# Altium project P22296-2-DES.PrjPcb
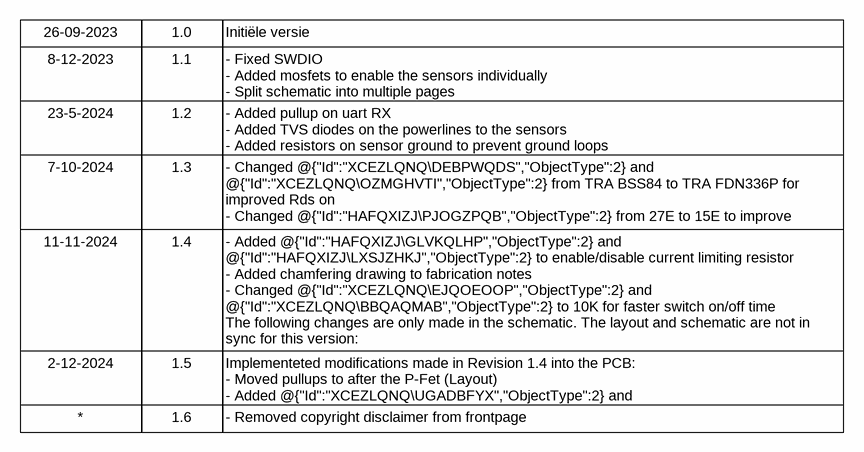
[diagram p0: Frontpage.SchDoc]
VolgNumber: 2; ProjectRev: 1.6; ProjectNumber: P22296; Project: MFM Sensor board; ProductNumber: P4750; PCBRev: 1.4; DrawnBy: KRS; Drawingnumber: P22296-2-DES-1; DCISheetTotal: 4
5 sheets, 95 parts. Net scope: global (net labels, ports and power ports of the same name join across sheets).
Board file: P22296-2-PCB.PcbDoc
Sheets:
  Frontpage.SchDoc
  MCU.SchDoc
  Sensor Interface.SchDoc
  Power.SchDoc
  Mechanical.SchDoc

## Sheet Frontpage.SchDoc: Titel
size A4 portrait; ApprovedBy: name; CompanyName: DCI Electronics bv; DrawnBy: KRS; Address1: Nijverheidsstraat 14; Address2: 4458 AV Eindewege; Address3: Phone: +31 (0)113 344880; DocumentNumber: 0; Revision: 0; SheetNumber: 1; SheetTotal: 5; PageSetup: Record=PageOptions|CenterHorizontal=True|CenterVertical=True|PrintScale=1.00|XCorrection=1.00|YCorrection=1.00|PrintKind=1|BorderSize=5000000|LeftOffset=0|BottomOffset=0|Orientation=2|PaperLength=1000|PaperWidth=1000|Scale=100|PaperSource=7|PrintQuality=-4|MediaType=1|DitherType=10|PaperKind=ISO_A4_(210.00_x_297.00_MM)|PrintScaleMode=1; SubTitle: SubTitel; ApprovedDate: 01-01-12; DesignedBy: KRS

### Notes on the sheet
- 26-09-2023
- 1.0
- Initiële versie
- 8-12-2023
- 1.1
- - Fixed SWDIO
  - Added mosfets to enable the sensors individually
  - Split schematic into multiple pages
- 23-5-2024
- 1.2
- - Added pullup on uart RX
  - Added TVS diodes on the powerlines to the sensors
  - Added resistors on sensor ground to prevent ground loops
- 7-10-2024
- 1.3
- - Changed @{"Id":"XCEZLQNQ\DEBPWQDS","ObjectType":2} and @{"Id":"XCEZLQNQ\OZMGHVTI","ObjectType":2} from TRA BSS84 to TRA FDN336P for improved Rds on
  - Changed @{"Id":"HAFQXIZJ\PJOGZPQB","ObjectType":2} from 27E to 15E to improve Vsensor stability
  - Changed ground loop resistors @{"Id":"XCEZLQNQ\VHNZZZWU","ObjectType":2} and @{"Id":"XCEZLQNQ\JQTFWMYG","ObjectType":2} to 0E
  - Changed Vsensor from 3V3 to 3V6
- 11-11-2024
- 1.4
- - Added @{"Id":"HAFQXIZJ\GLVKQLHP","ObjectType":2} and @{"Id":"HAFQXIZJ\LXSJZHKJ","ObjectType":2} to enable/disable current limiting resistor
  - Added chamfering drawing to fabrication notes
  - Changed @{"Id":"XCEZLQNQ\EJQOEOOP","ObjectType":2} and @{"Id":"XCEZLQNQ\BBQAQMAB","ObjectType":2} to 10K for faster switch on/off time
  The following changes are only made in the schematic. The layout and schematic are not in sync for this version:
  - Moved pullups to after the P-Fet (Schematic only)
  - Added @{"Id":"XCEZLQNQ\UGADBFYX","ObjectType":2} and @{"Id":"XCEZLQNQ\RXYZURVO","ObjectType":2} to limit current to MCU IO pin (Schematic only)
- 2-12-2024
- 1.5
- 1.6
- Implementeted modifications made in Revision 1.4 into the PCB:
  - Moved pullups to after the P-Fet (Layout)
  - Added @{"Id":"XCEZLQNQ\UGADBFYX","ObjectType":2} and @{"Id":"XCEZLQNQ\RXYZURVO","ObjectType":2} to limit current to MCU IO pin (Layout)
- - Removed copyright disclaimer from frontpage
- Hardware Documentation
- Project:
- Product:
- Variant:
- Dekimo Goes B.V.
- Nijverheidsstraat 14, 4458 AV  Eindewege, Phone: +31 (0)113 344880
- History Table
- Date
- Revision
- Remarks/Changes

## Sheet MCU.SchDoc: Titel
size A3; DesignedDate: 01-01-12; CompanyName: DCI Electronics bv; DrawnBy: KRS; Organization: DCI Electronics; Address1: Nijverheidsstraat 14; Address2: 4458 AV Eindewege; Address3: Phone: +31 (0)113 344880; DocumentNumber: 1; Revision: 1; SheetNumber: 2; SheetTotal: 5; PageSetup: Record=PageOptions|CenterHorizontal=True|CenterVertical=True|PrintScale=1.00|XCorrection=1.00|YCorrection=1.00|PrintKind=1|BorderSize=5000000|LeftOffset=0|BottomOffset=0|Orientation=2|PaperLength=1000|PaperWidth=1000|Scale=100|PaperSource=7|PrintQuality=-4|MediaType=1|DitherType=10|PaperKind=ISO_A4_(210.00_x_297.00_MM)|PrintScaleMode=1; SubTitle: SubTitel; ApprovedDate: 01-01-21; DesignedBy: KRS
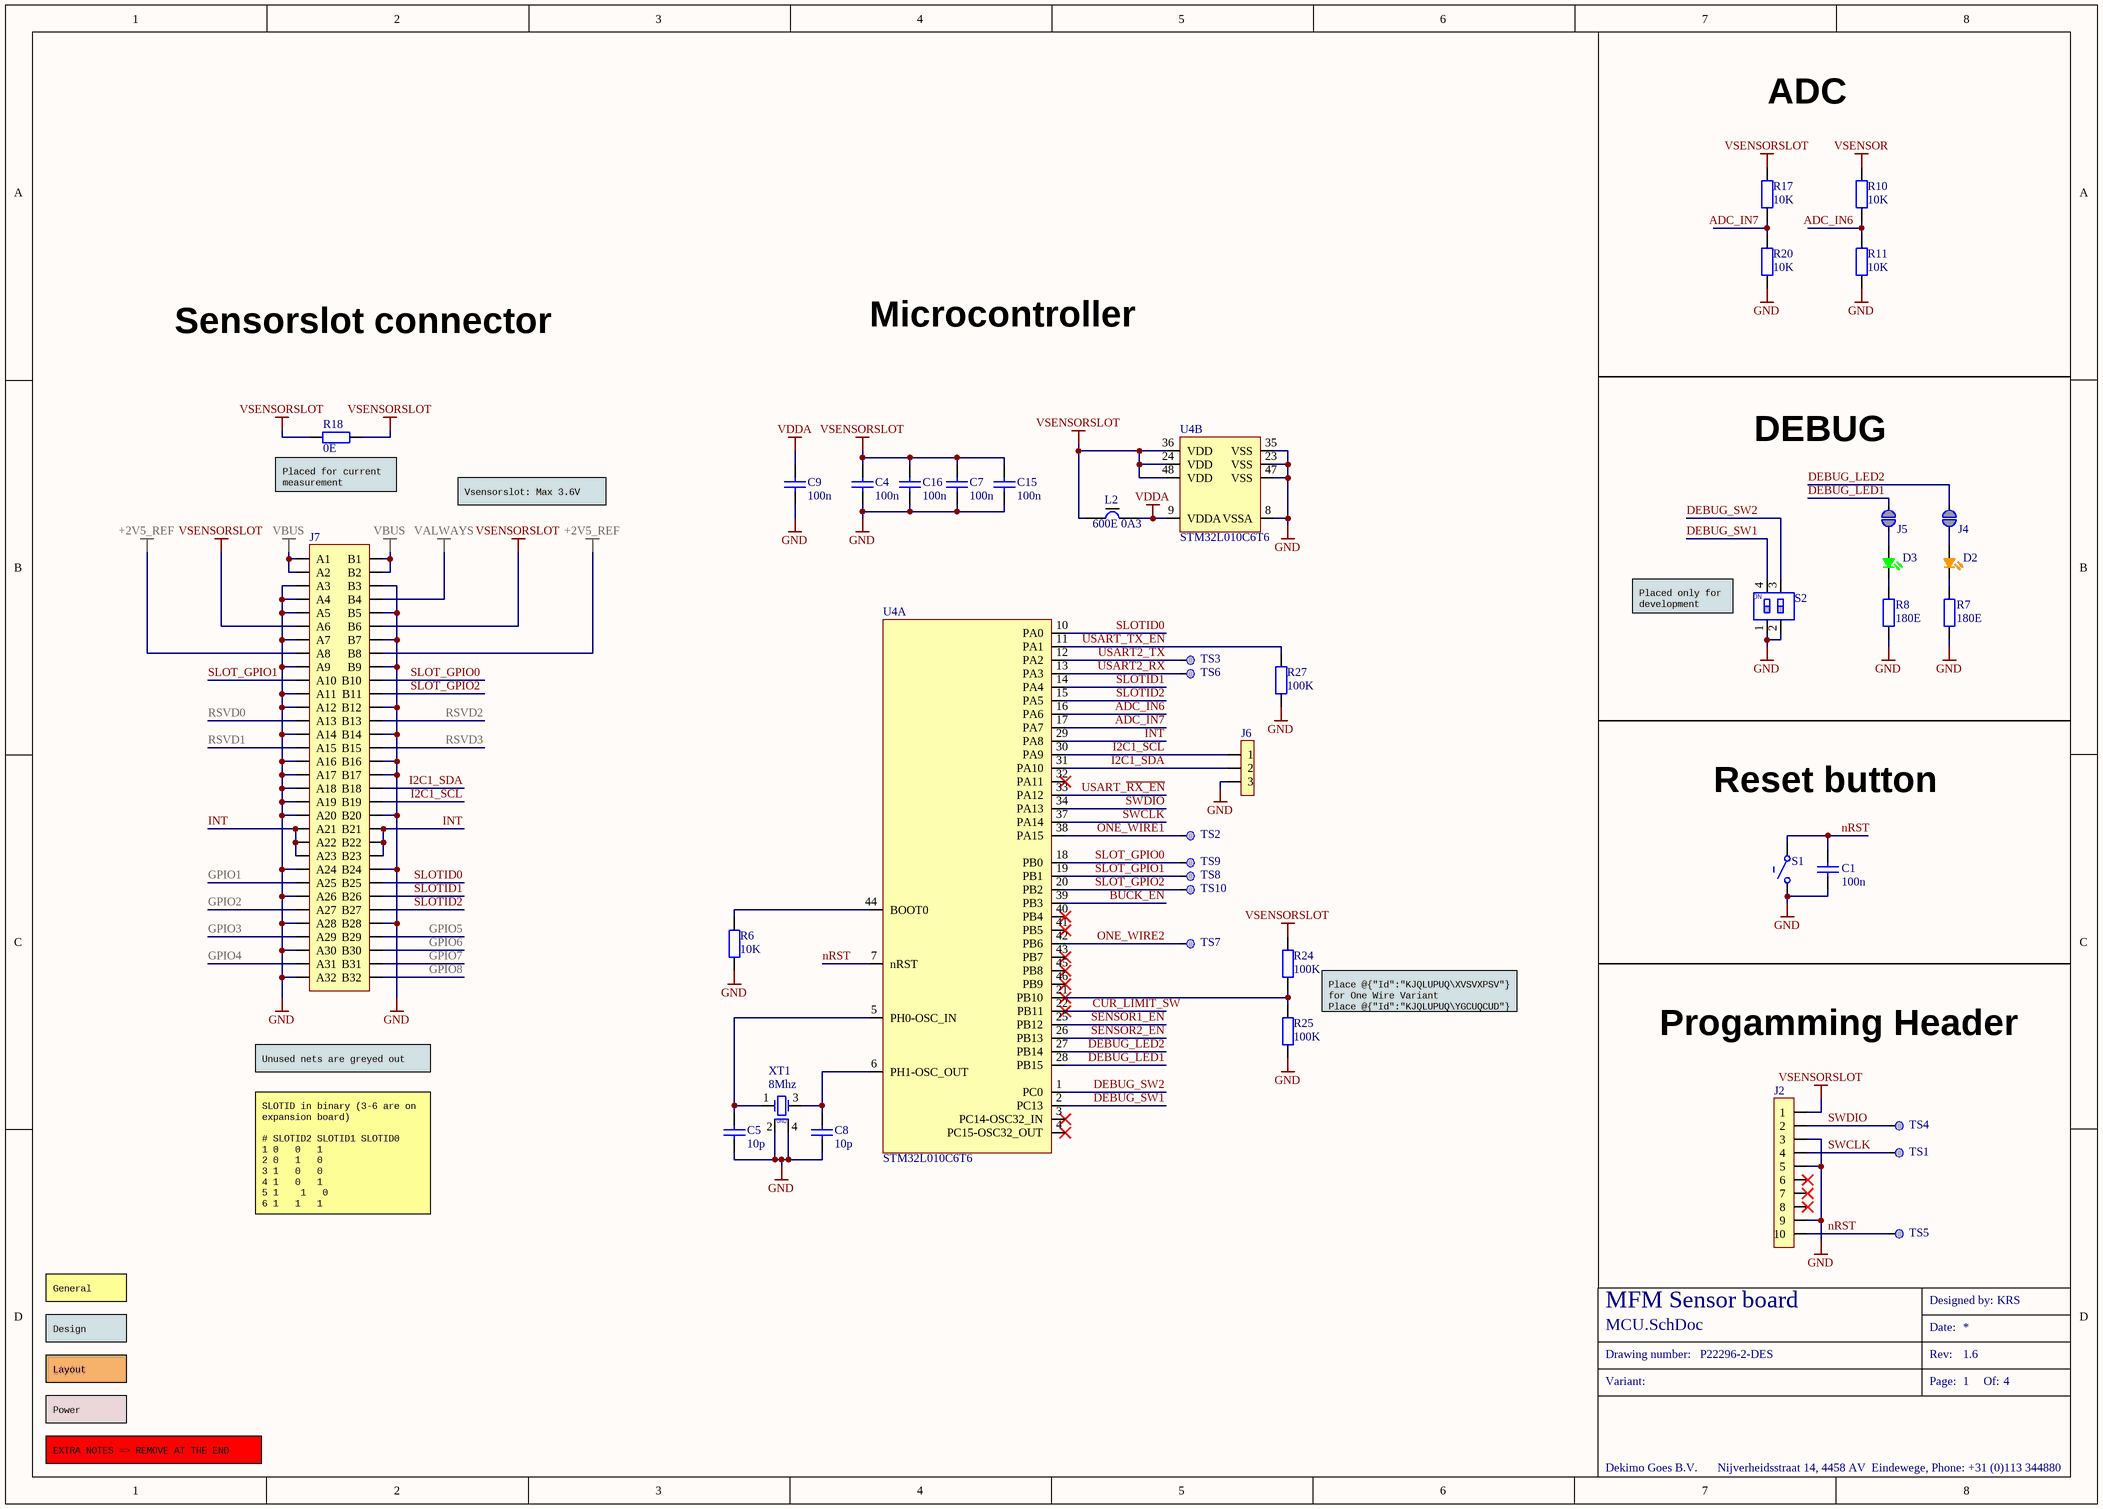
[diagram p1: MCU.SchDoc]

### Parts
C1  100n  [CAPC1608X09N]
C4  100n  [CAPC1608X09N]
C5  10p  [CAPC1608X09N]
C7  100n  [CAPC1608X09N]
C8  10p  [CAPC1608X09N]
C9  100n  [CAPC1608X09N]
C15  100n  [CAPC1608X09N]
C16  100n  [CAPC1608X09N]
D2  (no value)  [LED_0603]
D3  LED_GREEN  [LED_0603_ANODE]  (value not drawn)
J2  Harwin Archer M50 Series  [PHDR2X5_SMD_P1.27]  (value not drawn)
J4  (no value)  [Solderbridge NO]  (no BOM)
J5  (no value)  [Solderbridge NO]  (no BOM)
J6  (no value)  [PHDR1X3_P2.54]
J7  (no value)  [CON-900000-064]  (no BOM)
L2  600E 0A3  [INDC1608X10N]
R6  10K  [RESC1608X13N]
R7  180E  [RESC1608X13N]
R8  180E  [RESC1608X13N]
R10  10K  [RESC1608X13N]
R11  10K  [RESC1608X13N]
R17  10K  [RESC1608X13N]
R18  0E  [RESC1608X13N]
R20  10K  [RESC1608X13N]
R24  100K  [RESC1608X13N]
R25  100K  [RESC1608X13N]
R27  100K  [RESC1608X13N]
S1  (no value)  [B3S-1000P]
S2  (no value)  [SW_GDH02S04]
TS1  TESTPAD-1.5  [testpad 1.5 mm]  (value not drawn)  (no BOM)
TS2  TESTPAD-1.5  [testpad 1.5 mm]  (value not drawn)  (no BOM)
TS3  TESTPAD-1.5  [testpad 1.5 mm]  (value not drawn)  (no BOM)
TS4  TESTPAD-1.5  [testpad 1.5 mm]  (value not drawn)  (no BOM)
TS5  TESTPAD-1.5  [testpad 1.5 mm]  (value not drawn)  (no BOM)
TS6  TESTPAD-1.5  [testpad 1.5 mm]  (value not drawn)  (no BOM)
TS7  TESTPAD-1.5  [testpad 1.5 mm]  (value not drawn)  (no BOM)
TS8  TESTPAD-1.5  [testpad 1.5 mm]  (value not drawn)  (no BOM)
TS9  TESTPAD-1.5  [testpad 1.5 mm]  (value not drawn)  (no BOM)
TS10  TESTPAD-1.5  [testpad 1.5 mm]  (value not drawn)  (no BOM)
U4  STM32L010C6T6  [QFP-500001-048]  (parts A,B of 2)
XT1  8Mhz  [XTL-001G002-004]

### Blocks framed on the sheet
ADC: R10 R11 R17 R20
DEBUG: D2 D3 J4 J5 R7 R8 S2
Reset button: C1 S1
Progamming Header: J2 TS1 TS4 TS5

### Nets
+2V5_REF: J7.A8 J7.B8
GND: C1.1 C4.1 C5.1 C7.1 C8.1 C9.1 C15.1 C16.1 J2.3 J2.5 J2.9 J6.3 J7.A3 J7.A4 J7.A5 J7.A7 J7.A9 J7.A11 J7.A12 J7.A14 J7.A16 J7.A17 J7.A18 J7.A19 J7.A20 J7.A24 J7.A26 J7.A28 J7.A30 J7.A32 J7.B3 J7.B5 J7.B7 J7.B9 J7.B12 J7.B14 J7.B16 J7.B17 J7.B20 J7.B24 J7.B28 R6.1 R7.1 R8.1 R11.1 R20.1 R25.1 R27.1 S1.NO1(NO) S2.1(A1) S2.2(A2) U4.8(VSSA) U4.23(VSS) U4.35(VSS) U4.47(VSS) XT1.2 XT1.4
VALWAYS: J7.B4
VBUS: J7.A1 J7.A2 J7.B1 J7.B2
VDDA: C9.2 L2.2 U4.9(VDDA)
VSENSOR: R10.2
VSENSORSLOT: C4.2 C7.2 C15.2 C16.2 J2.1 J7.A6 J7.B6 L2.1 R17.2 R18.1 R18.2 R24.2 U4.24(VDD) U4.36(VDD) U4.48(VDD)
ADC_IN6: R10.1 R11.2 U4.16(PA6)
ADC_IN7: R17.1 R20.2 U4.17(PA7)
BUCK_EN: U4.39(PB3)
CUR_LIMIT_SW: U4.22(PB11)
DEBUG_LED1: J5.2 U4.28(PB15)
DEBUG_LED2: J4.2 U4.27(PB14)
DEBUG_SW1: S2.4(B1) U4.2(PC13)
DEBUG_SW2: S2.3(B2) U4.1(PC0)
GPIO1: J7.A25
GPIO2: J7.A27
GPIO3: J7.A29
GPIO4: J7.A31
GPIO5: J7.B29
GPIO6: J7.B30
GPIO7: J7.B31
GPIO8: J7.B32
I2C1_SCL: J6.1 J7.B19 U4.30(PA9)
I2C1_SDA: J6.2 J7.B18 U4.31(PA10)
INT: J7.A21 J7.A22 J7.A23 J7.B21 J7.B22 J7.B23 U4.29(PA8)
nRST: C1.2 J2.10 S1.COM1(COMMON) TS5.1(TP) U4.7(nRST)
ONE_WIRE1: TS2.1(TP) U4.38(PA15)
ONE_WIRE2: TS7.1(TP) U4.42(PB6)
RSVD0: J7.A13
RSVD1: J7.A15
RSVD2: J7.B13
RSVD3: J7.B15
SENSOR1_EN: U4.25(PB12)
SENSOR2_EN: U4.26(PB13)
SLOT_GPIO0: J7.B10 TS9.1(TP) U4.18(PB0)
SLOT_GPIO1: J7.A10 TS8.1(TP) U4.19(PB1)
SLOT_GPIO2: J7.B11 TS10.1(TP) U4.20(PB2)
SLOTID0: J7.B25 U4.10(PA0)
SLOTID1: J7.B26 U4.14(PA4)
SLOTID2: J7.B27 U4.15(PA5)
SWCLK: J2.4 TS1.1(TP) U4.37(PA14)
SWDIO: J2.2 TS4.1(TP) U4.34(PA13)
USART2_RX: TS6.1(TP) U4.13(PA3)
USART2_TX: TS3.1(TP) U4.12(PA2)
USART_~{RX_EN}: U4.33(PA12)
USART_TX_EN: R27.2 U4.11(PA1)
NetC5_2: C5.2 U4.5(PH0-OSC_IN) XT1.1(OSC1)
NetC8_2: C8.2 U4.6(PH1-OSC_OUT) XT1.3(OSC2)
NetD2_A: D2.A J4.1
NetD2_C: D2.C R7.2
NetD3_A: D3.A J5.1
NetD3_C: D3.C R8.2
NetR6_2: R6.2 U4.44(BOOT0)
NetR24_1: R24.1 R25.2 U4.21(PB10)

Not connected (* = marked no-connect by the designer): J2 6* 7* 8*; U4 3(PC14-OSC32_IN)* 4(PC15-OSC32_OUT)* 32(PA11)* 40(PB4)* 41(PB5)* 43(PB7)* 45(PB8)* 46(PB9)*

### Notes on the sheet
- Sensorslot connector
- Microcontroller
- (near R18) Placed for current measurement
- Vsensorslot: Max 3.6V
- (near S2) Placed only for development
- Place @{"Id":"KJQLUPUQ\XVSVXPSV"} for One Wire Variant
  Place @{"Id":"KJQLUPUQ\YGCUQCUD"} for RS485 Variant
- Unused nets are greyed out
- SLOTID in binary (3-6 are on expansion board)
  # SLOTID2 SLOTID1 SLOTID0
  1 0	  0	  1
  2 0	  1	  0
  3 1	  0	  0
  4 1	  0	  1
  5 1 	  1	  0
  6 1	  1	  1
- General
- Design
- Layout
- Power
- EXTRA NOTES => REMOVE AT THE END
- Designed by:
- Drawing number:
- Variant:
- Date:
- Page:
- Rev:
- Of:
- Dekimo Goes B.V.
- Nijverheidsstraat 14, 4458 AV  Eindewege, Phone: +31 (0)113 344880
- (in symbol SW DIP2SO/G2) ON
- (in symbol XT 8MHZ/1) GND

### Library data of the parts
C1 C4 C7 C9 C15 C16 = CKE 100N/60: 100nF 50V 10% X7R; EngPartGrpMainCode: CAP; ManufactpartCode: CC0603KRX7R9BB104-YAG; Type: Capacitor ceramic SMD; Preferred: False; SMD_Flag: True; PartCode: CKE 100N/60
C5 C8 = CKE 10P/60: 10pF 50V 5% C0G/NP0; EngPartGrpMainCode: CAP; ManufactpartCode: C1608C0G1H100D080AA-TDK; Type: Capacitor ceramic SMD; Preferred: False; SMD_Flag: True; PartCode: CKE 10P/60
D2 = LED SMDO/3: Led Orange 0603; EngPartGrpMainCode: OPTO; ManufactpartCode: 150060AS75000-WE; Type: LED SMD; Preferred: False; SMD_Flag: True; PartCode: LED SMDO/3
D3 = LED SMDG/16: Led Groen 0603; EngPartGrpMainCode: OPTO; ManufactpartCode: 150060VS75003-WE; Type: LED SMD; Preferred: False; SMD_Flag: True; PartCode: LED SMDG/16
J2 = CON PHDR2X5S/10: pinh 2x5/straight/Au/1.27pitch; EngPartGrpMainCode: CONN; ManufactpartCode: M50-3600542-HAR; Preferred: False; SMD_Flag: True; PartCode: CON PHDR2X5S/10; Type: Connector pinhdr SMD
J4 J5 = SolderbridgeNO: Solderbridge  - Normally Open
J6 = CON PHDR1X3S/1: pinh 1x3/straight/h=5.8/Au; EngPartGrpMainCode: CONN; ManufactpartCode: 0-826629-3; Preferred: False; PartCode: CON PHDR1X3S/1; Type: Connector Pinheader; SMD_Flag: False
J7 = PCIe x4 Card edge
L2 = IND 600E 0A3/1: 600E @100Mhz 0.3A; EngPartGrpMainCode: IND; ManufactpartCode: 742792653-WE; Type: Ferrite bead SMD; Preferred: False; SMD_Flag: True; PartCode: IND 600E 0A3/1
R6 R10 R11 R17 R20 = R 10K/60: 10k 100mW, 1%; EngPartGrpMainCode: RES; ManufactpartCode: RC0603FR-0710KL-YAG; Preferred: True; PartCode: R 10K/60; Type: Resistor metalfilm SMD; SMD_Flag: True
R7 R8 = R 180E/60: 180E 0.1W 1%; EngPartGrpMainCode: RES; ManufactpartCode: RC0603FR-07180RL-YAG; Preferred: False; SMD_Flag: True; PartCode: R 180E/60; Type: Resistor metalfilm SMD
R18 = R 0E/60: 0E 100mW, 1%; PartCode: R 0E/60; EngPartGrpMainCode: RES; ManufactpartCode: RC0603FR-070RL-YAG; Preferred: True; Type: Resistor metalfilm SMD; SMD_Flag: True
R24 R25 R27 = R 100K/60: 100k 100mW, 1%; EngPartGrpMainCode: RES; ManufactpartCode: CRG0603F100K-TEC; Preferred: True; PartCode: R 100K/60; Type: Resistor metalfilm SMD; SMD_Flag: True
S1 = SW PBSPNO/25: PCB SPNO 6x6.6mm, h=4,3mm refl; EngPartGrpMainCode: SWI; ManufactpartCode: B3S-1000P-OMR; Preferred: False; SMD_Flag: True; PartCode: SW PBSPNO/25; Type: Switch push button SMD
S2 = SW DIP2SO/G2: DIP,2p,Straight,H=2,3mm,SMD,AU; EngPartGrpMainCode: SWI; ManufactpartCode: GDH02S04-TYC; Preferred: False; SMD_Flag: True; PartCode: SW DIP2SO/G2; Type: Switch slide SMD
TS1-TS10 = TESTPAD-1.5: 1.5mm Testpad SMD; PartCode: TESTPAD-1.5
U4 = IC STM32L010C6T: EngPartGrpMainCode: IC; ManufactpartCode: STM32L010C6T6-STM; Preferred: False; SMD_Flag: True; ComponentLink2Description: Datasheet; ComponentLink2URL: https://nl.mouser.com/datasheet/2/389/stm32l010c6-1760926.pdf; Supplier 1: Mouser; Supplier 2: Digi-Key; Supplier 3: Farnell; Supplier Part Number 1: 511-STM32L010C6T6; Supplier Part Number 2: 497-19662-ND; Supplier Part Number 3: 2980880; PartCode: IC STM32L010C6T; Type: IC microcontroller SMD
XT1 = XT 8MHZ/1: 8 MHz, 10%, 30ppm; EngPartGrpMainCode: XTAL; ManufactpartCode: ECS-80-10-33-CGN-TR3-ECS; Preferred: False; SMD_Flag: True; PartCode: XT 8MHZ/1; Type: Quarz crystal SMD

## Sheet Sensor Interface.SchDoc: Titel
size A4; ApprovedBy: name; CompanyName: DCI Electronics bv; DrawnBy: KRS; Address1: Nijverheidsstraat 14; Address2: 4458 AV Eindewege; Address3: Phone: +31 (0)113 344880; DocumentNumber: 2; Revision: 0; SheetNumber: 3; SheetTotal: 5; PageSetup: Record=PageOptions|CenterHorizontal=True|CenterVertical=True|PrintScale=1.00|XCorrection=1.00|YCorrection=1.00|PrintKind=1|BorderSize=5000000|LeftOffset=0|BottomOffset=0|Orientation=2|PaperLength=1000|PaperWidth=1000|Scale=100|PaperSource=7|PrintQuality=-4|MediaType=1|DitherType=10|PaperKind=ISO_A4_(210.00_x_297.00_MM)|PrintScaleMode=1; SubTitle: SubTitel; ApprovedDate: 01-01-12; DesignedBy: KRS
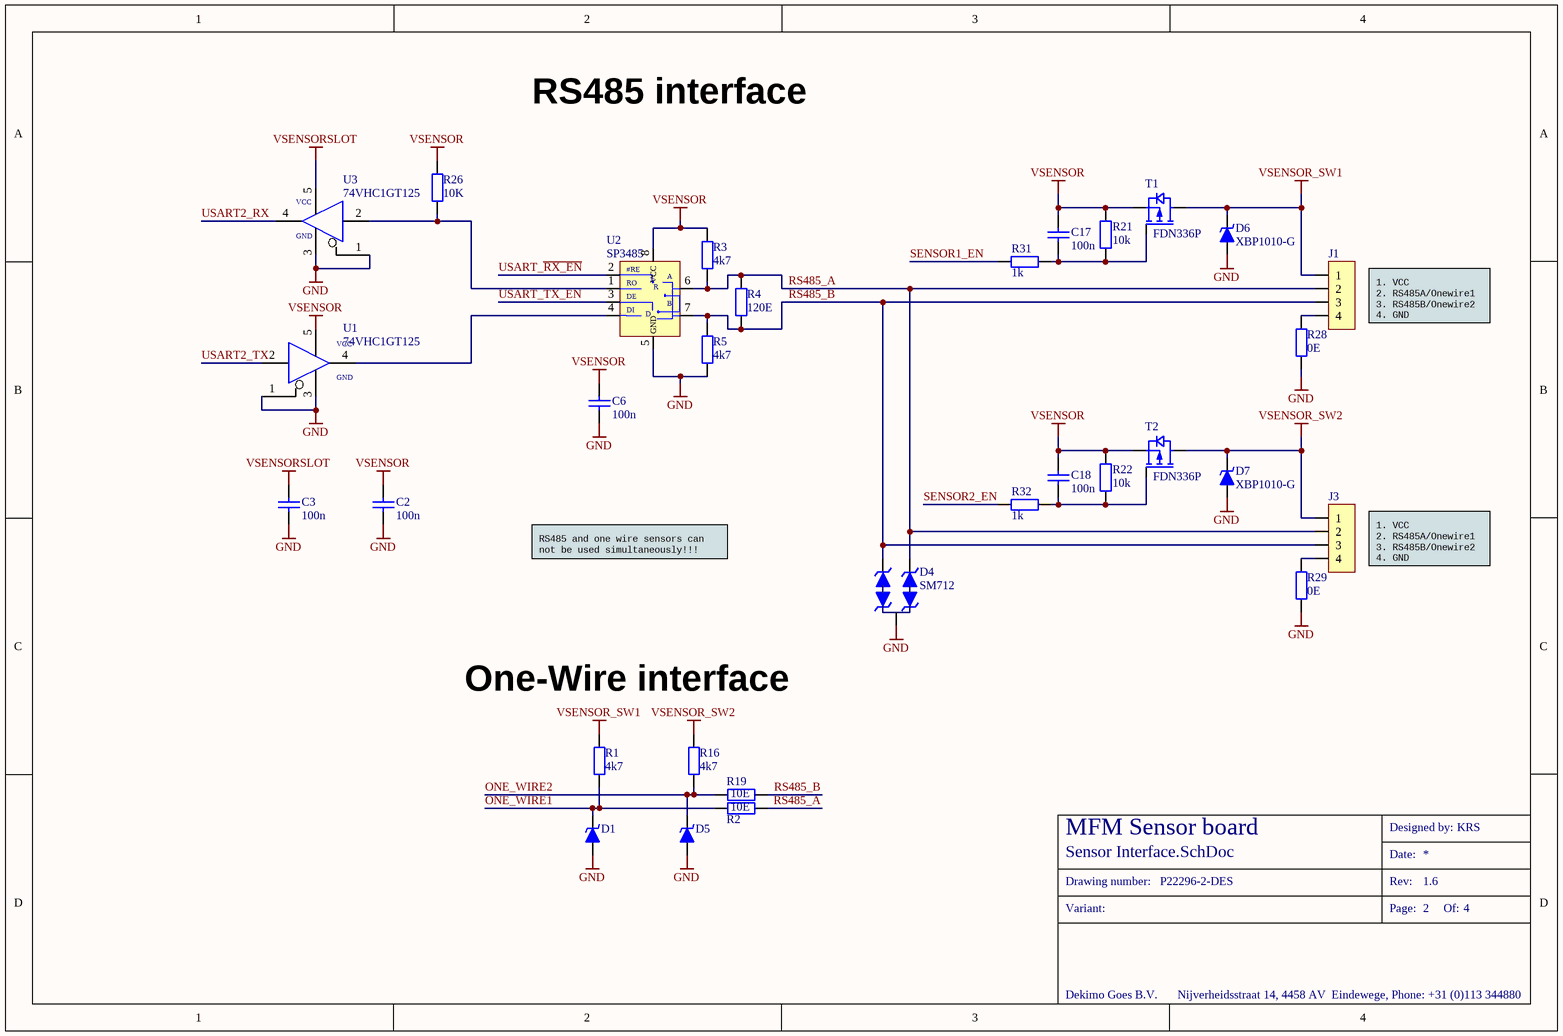
[diagram p2: Sensor Interface.SchDoc]

### Parts
C2  100n  [CAPC1608X09N]
C3  100n  [CAPC1608X09N]
C6  100n  [CAPC1608X09N]
C17  100n  [CAPC1608X09N]
C18  100n  [CAPC1608X09N]
D1  D3V3M1U2S9  [SOD946]  (value not drawn)
D4  SM712  [SOT95P245X110-C1C2C-3N]
D5  D3V3M1U2S9  [SOD946]  (value not drawn)
D6  XBP1010-G  [SODFL120X40-2N]
D7  XBP1010-G  [SODFL120X40-2N]
J1  4PIN  [WE_691322310004]  (value not drawn)
J3  4PIN  [WE_691322310004]  (value not drawn)
R1  4k7  [RESC1608X13N]
R2  10E  [RESC1608X13N]
R3  4k7  [RESC1608X13N]
R4  120E  [RESC1608X13N]
R5  4k7  [RESC1608X13N]
R16  4k7  [RESC1608X13N]
R19  10E  [RESC1608X13N]
R21  10k  [RESC1608X13N]
R22  10k  [RESC1608X13N]
R26  10K  [RESC1608X13N]
R28  0E  [RESC1608X13N]
R29  0E  [RESC1608X13N]
R31  1k  [RESC1005x04N]
R32  1k  [RESC1005x04N]
T1  FDN336P  [SOT95P245X110_GSD-3N]
T2  FDN336P  [SOT95P245X110_GSD-3N]
U1  74VHC1GT125  [SOT95P280X145-5N]
U2  SP3485  [SOIC127P600X175-8N]
U3  74VHC1GT125  [SOT95P280X145-5N]

### Nets
GND: C2.1 C3.1 C6.1 D1.A D4.C D5.A D6.A D7.A R5.1 R28.1 R29.1 U1.1(~{OE}) U1.3(GND) U2.5(GND) U3.1(~{OE}) U3.3(GND)
VSENSOR: C2.2 C6.2 C17.2 C18.2 R3.2 R21.2 R22.2 R26.2 T1.S T2.S U1.5(VDD) U2.8(VCC)
VSENSOR_SW1: D6.C J1.1 R1.2 T1.D
VSENSOR_SW2: D7.C J3.1 R16.2 T2.D
VSENSORSLOT: C3.2 U3.5(VDD)
ONE_WIRE1: D1.C R1.1 R2.2
ONE_WIRE2: D5.C R16.1 R19.2
RS485_A: D4.C2 J1.2 J3.2 R2.1 R3.1 R4.2 U2.6(A)
RS485_B: D4.C1 J1.3 J3.3 R4.1 R5.2 R19.1 U2.7(B)
SENSOR1_EN: R31.1
SENSOR2_EN: R32.1
USART2_RX: U3.4(Y)
USART2_TX: U1.2(A)
USART_~{RX_EN}: U2.2(~{RE})
USART_TX_EN: U2.3(DE)
NetC17_1: C17.1 R21.1 R31.2 T1.G
NetC18_1: C18.1 R22.1 R32.2 T2.G
NetJ1_4: J1.4 R28.2
NetJ3_4: J3.4 R29.2
NetR26_1: R26.1 U2.1(RO) U3.2(A)
NetU1_4: U1.4(Y) U2.4(DI)

### Notes on the sheet
- RS485 interface
- (near J1) 1. VCC
  2. RS485A/Onewire1
  3. RS485B/Onewire2
  4. GND
- RS485 and one wire sensors can not be used simultaneously!!!
- (near J3) 1. VCC
  2. RS485A/Onewire1
  3. RS485B/Onewire2
  4. GND
- One-Wire interface
- Designed by:
- Drawing number:
- Variant:
- Date:
- Page:
- Rev:
- Of:
- Dekimo Goes B.V.
- Nijverheidsstraat 14, 4458 AV  Eindewege, Phone: +31 (0)113 344880
- (in symbol IC 74VHC1GT125) VCC
- (in symbol IC MAX3485/ETSO) #RE; R; D

### Library data of the parts
C2 C3 C6 C17 C18 = CKE 100N/60: as C1 on sheet MCU; PartCode: CKE 100N/60
D1 D5 = DIO D3V3M1U2S9: TVS diode 3.3V unidirec; EngPartGrpMainCode: DIO; ManufactpartCode: D3V3M1U2S9-7-DIO; Type: Diode suppressor SMD; Preferred: False; SMD_Flag: True; PartCode: DIO D3V3M1U2S9
D4 = DIO SM712: 7/12V, 400W bidir.; EngPartGrpMainCode: DIO; ManufactpartCode: SM712-LTL; Type: Diode suppressor SMD; Preferred: False; SMD_Flag: True; PartCode: DIO SM712
D6 D7 = DIO XBP1010-G: TVS Unidirectional 5V 40w; EngPartGrpMainCode: DIO; ManufactpartCode: XBP1010-G-TOR; Type: Diode suppressor SMD; Preferred: False; SMD_Flag: True; PartCode: DIO XBP1010-G
J1 J3 = CON PTB4/31: PCB,BOX,RY1,PEN4,HA,P3.81; EngPartGrpMainCode: CONN; ManufactpartCode: 691322310004-WE; Preferred: False; PartCode: CON PTB4/31; Type: Plug-in term. block; SMD_Flag: False
R1 R3 R5 R16 = R 4K7/60: 4k7 100mW 1% 0603; EngPartGrpMainCode: RES; ManufactpartCode: RC0603FR-074K7L-YAG; Preferred: False; SMD_Flag: True; PartCode: R 4K7/60; Type: Resistor metalfilm SMD
R2 R19 = R 10E/60: 10E 0.1W 1%; EngPartGrpMainCode: RES; ManufactpartCode: RC0603FR-0710RL-YAG; Preferred: False; SMD_Flag: True; PartCode: R 10E/60; Type: Resistor metalfilm SMD
R4 = R 120E/60: 120E 0.1W 1%; EngPartGrpMainCode: RES; ManufactpartCode: RC0603FR-07120RL-YAG; Preferred: False; SMD_Flag: True; PartCode: R 120E/60; Type: Resistor metalfilm SMD
R21 R22 = R 10K/60: 10kΩ 100mW 1%; EngPartGrpMainCode: RES; ManufactpartCode: RC0603FR-0710KL-YAG; Preferred: True; PartCode: R 10K/60; Type: Resistor metalfilm SMD; SMD_Flag: True
R26 = R 10K/60: as R6 on sheet MCU; PartCode: R 10K/60; Type: Resistor metalfilm SMD; SMD_Flag: True
R28 R29 = R 0E/60: 0Ω 100mW 1%; PartCode: R 0E/60; EngPartGrpMainCode: RES; ManufactpartCode: RC0603FR-070RL-YAG; Preferred: True; Type: Resistor metalfilm SMD; SMD_Flag: True
R31 R32 = R 1K/70: 1kΩ 62.5mW 1%; PartCode: R 1K/70; EngPartGrpMainCode: RES; ManufactpartCode: RC0402FR-071KL-YAG; Preferred: False; SMD_Flag: True; Type: Resistor metalfilm SMD
T1 T2 = TRA FDN336P: 20V 1.3A 200mΩ logic level; EngPartGrpMainCode: TRAN; ManufactpartCode: FDN336P-FCH; Type: FET P-channel SMD; Preferred: False; SMD_Flag: True; PartCode: TRA FDN336P
U1 U3 = IC 74VHC1GT125: buffer/ levelshifter; EngPartGrpMainCode: IC; ManufactpartCode: M74VHC1GT125DT1G-ONS; Preferred: False; SMD_Flag: True; PartCode: IC 74VHC1GT125; Type: IC interface SMD
U2 = IC MAX3485/ETSO: RS485/RS422, 3v3, 10Mbps; EngPartGrpMainCode: IC; ManufactpartCode: SP3485EN-L-SIP; Preferred: False; SMD_Flag: True; PartCode: IC MAX3485/ETSO; Type: IC interface SMD

## Sheet Power.SchDoc: Titel
size A4; ApprovedBy: name; CompanyName: DCI Electronics bv; DrawnBy: KRS; Address1: Nijverheidsstraat 14; Address2: 4458 AV Eindewege; Address3: Phone: +31 (0)113 344880; DocumentNumber: 3; Revision: 0; SheetNumber: 4; SheetTotal: 5; PageSetup: Record=PageOptions|CenterHorizontal=True|CenterVertical=True|PrintScale=1.00|XCorrection=1.00|YCorrection=1.00|PrintKind=1|BorderSize=5000000|LeftOffset=0|BottomOffset=0|Orientation=2|PaperLength=1000|PaperWidth=1000|Scale=100|PaperSource=7|PrintQuality=-4|MediaType=1|DitherType=10|PaperKind=ISO_A4_(210.00_x_297.00_MM)|PrintScaleMode=1; SubTitle: SubTitel; ApprovedDate: 01-01-12; DesignedBy: KRS
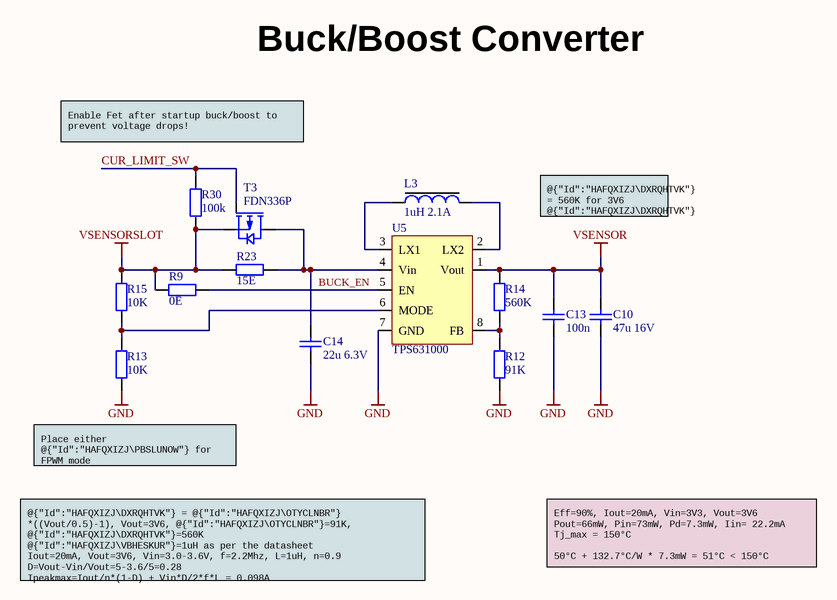
[diagram p3: Power.SchDoc]

### Parts
C10  47u 16V  [CAPC3225X27N]
C13  100n  [CAPC1608X09N]
C14  22u 6.3V  [CAPC1608X09N]
L3  1uH 2.1A  [IND-001G002-002]
R9  0E  [RESC1608X13N]
R12  91K  [RESC1608X13N]
R13  10K  [RESC1608X13N]
R14  560K  [RESC1608X13N]
R15  10K  [RESC1608X13N]
R23  15E  [RESC2013X14N]
R30  100k  [RESC1608X13N]
T3  FDN336P  [SOT95P245X110_GSD-3N]
U5  TPS631000  [SOT-501001-008]

### Nets
GND: C10.1 C13.1 C14.1 R12.1 R13.1 U5.7(GND)
VSENSOR: C10.2 C13.2 R14.2 U5.1(Vout)
VSENSORSLOT: R9.2 R15.2 R23.1 R30.1 T3.S
BUCK_EN: R9.1 U5.5(EN)
CUR_LIMIT_SW: R30.2 T3.G
NetC14_2: C14.2 R23.2 T3.D U5.4(Vin)
NetL3_1: L3.1 U5.3(LX1)
NetL3_2: L3.2 U5.2(LX2)
NetR12_2: R12.2 R14.1 U5.8(FB)
NetR13_2: R13.2 R15.1 U5.6(MODE)

### Notes on the sheet
- Buck/Boost Converter
- Enable Fet after startup buck/boost to prevent voltage drops!
- @{"Id":"HAFQXIZJ\DXRQHTVK"} = 560K for 3V6
  @{"Id":"HAFQXIZJ\DXRQHTVK"} = 806K for 5V
- (near R13) Place either @{"Id":"HAFQXIZJ\PBSLUNOW"} for FPWM mode
  or @{"Id":"HAFQXIZJ\QUYZTFQX"} for PFM mode
- Eff=90%, Iout=20mA, Vin=3V3, Vout=3V6
  Pout=66mW, Pin=73mW, Pd=7.3mW, Iin= 22.2mA
  Tj_max = 150°C
  50°C + 132.7°C/W * 7.3mW = 51°C < 150°C
- @{"Id":"HAFQXIZJ\DXRQHTVK"} = @{"Id":"HAFQXIZJ\OTYCLNBR"} *((Vout/0.5)-1), Vout=3V6, @{"Id":"HAFQXIZJ\OTYCLNBR"}=91K, @{"Id":"HAFQXIZJ\DXRQHTVK"}=560K
  @{"Id":"HAFQXIZJ\VBHESKUR"}=1uH as per the datasheet
  Iout=20mA, Vout=3V6, Vin=3.0-3.6V, f=2.2Mhz, L=1uH, n=0.9
  D=Vout-Vin/Vout=5-3.6/5=0.28
  Ipeakmax=Iout/n*(1-D) + Vin*D/2*f*L = 0.098A
  Isaturation = 0.098A+20%= 118mA
- Designed by:
- Drawing number:
- Variant:
- Date:
- Page:
- Rev:
- Of:
- Dekimo Goes B.V.
- Nijverheidsstraat 14, 4458 AV  Eindewege, Phone: +31 (0)113 344880

### Library data of the parts
C10 = CKE 47UV16/15: 47uF 16V 20% X5R; EngPartGrpMainCode: CAP; ManufactpartCode: EMK325BJ476MM-P-TAI; Type: Capacitor ceramic SMD; Preferred: False; SMD_Flag: True; PartCode: CKE 47UV16/15
C13 = CKE 100N/60: as C1 on sheet MCU; PartCode: CKE 100N/60
C14 = CKE 22UV6.3/60: 22uF 20%  6.3V X5R; EngPartGrpMainCode: CAP; ManufactpartCode: GRM188R60J226MEA0D-MUR; Type: Capacitor ceramic SMD; Preferred: False; SMD_Flag: True; PartCode: CKE 22UV6.3/60
L3 = IND 1U 2A1/1: Power inductor 2.1A; EngPartGrpMainCode: IND; ManufactpartCode: 74479276210C-WE; Type: Inductor choke SMD; Preferred: False; SMD_Flag: True; PartCode: IND 1U 2A1/1
R9 = R 0E/60: as R18 on sheet MCU; Type: Resistor metalfilm SMD; SMD_Flag: True
R12 = R 91K/60: 91k 0.06W 1%; EngPartGrpMainCode: RES; ManufactpartCode: RC0603FR-0791KL-YAG; Preferred: False; SMD_Flag: True; PartCode: R 91K/60; Type: Resistor metalfilm SMD
R13 R15 = R 10K/60: as R6 on sheet MCU; PartCode: R 10K/60; Type: Resistor metalfilm SMD; SMD_Flag: True
R14 = R 560K/60: 560kΩ 100mW 1%; EngPartGrpMainCode: RES; ManufactpartCode: RC0603FR-07560KL-YAG; Preferred: False; SMD_Flag: True; PartCode: R 560K/60; Type: Resistor metalfilm SMD
R23 = R 15E/11: 15Ω 125mW 1%; EngPartGrpMainCode: RES; ManufactpartCode: RC0805FR-0715RL-YAG; Preferred: False; SMD_Flag: True; PartCode: R 15E/11; Type: Resistor metalfilm SMD
R30 = R 100K/60: 100kΩ 100mW 1%; EngPartGrpMainCode: RES; ManufactpartCode: CRG0603F100K-TEC; Preferred: True; PartCode: R 100K/60; Type: Resistor metalfilm SMD; SMD_Flag: True
T3 = TRA FDN336P: as T1 on sheet Sensor Interface; PartCode: TRA FDN336P
U5 = IC TPS631000: Buck/boost 1.5-5.5V, 1A5; EngPartGrpMainCode: IC; ManufactpartCode: TPS631000DRLR-TI; Preferred: False; SMD_Flag: True; PartCode: IC TPS631000; Type: IC regulator SMD

## Sheet Mechanical.SchDoc: Titel
size A4; DesignedDate: 01-01-12; CompanyName: DCI Electronics bv; Engineer: KRS; Organization: DCI Electronics; Address1: Nijverheidsstraat 14; Address2: 4458 AV Eindewege; Address3: Phone: +31 (0)113 344880; DocumentNumber: 4; Revision: 0; SheetNumber: 5; SheetTotal: 5; PageSetup: Record=PageOptions|CenterHorizontal=True|CenterVertical=True|PrintScale=1.00|XCorrection=1.00|YCorrection=1.00|PrintKind=1|BorderSize=5000000|LeftOffset=0|BottomOffset=0|Orientation=2|PaperLength=1000|PaperWidth=1000|Scale=100|PaperSource=7|PrintQuality=-4|MediaType=1|DitherType=10|PaperKind=ISO_A4_(210.00_x_297.00_MM)|PrintScaleMode=1; SubTitle: SubTitel; ApprovedDate: 01-01-12; DesignedBy: KRS; Designer: KRS
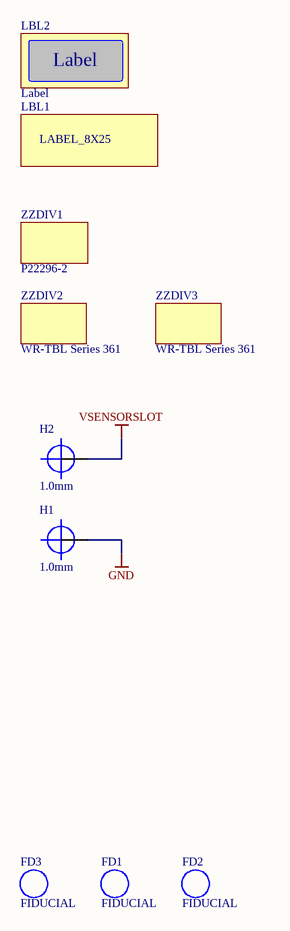
[diagram p4: Mechanical.SchDoc]

### Parts
FD1  FIDUCIAL  [fiducial1.5MM]
FD2  FIDUCIAL  [fiducial1.5MM]
FD3  FIDUCIAL  [fiducial1.5MM]
H1  1.0mm  [PTH_1.0_1.6]  (no BOM)
H2  1.0mm  [PTH_1.0_1.6]  (no BOM)
LBL1  (no value)  [Label_8x25]  (no BOM)
LBL2  Label  [LABEL_12.7X25.4]
ZZDIV1  P22296-2  (mechanical)
ZZDIV2  WR-TBL Series 361  (mechanical)
ZZDIV3  WR-TBL Series 361  (mechanical)

### Nets
GND: H1.0
VSENSORSLOT: H2.0

### Notes on the sheet
- Designed by:
- Drawing number:
- Variant:
- Date:
- Page:
- Rev:
- Of:
- Dekimo Goes B.V.
- Nijverheidsstraat 14, 4458 AV  Eindewege, Phone: +31 (0)113 344880

### Library data of the parts
H1 H2 = PTH-1.0: 1.0mm PTH; PartCode: PTH-1.0
LBL1 = LABEL_8X25
LBL2 = LBL STCK/20: Multi-funct labels12.7 x25.4mm; EngPartGrpMainCode: CASE; SMD_Flag: False; PartCode: LBL STCK/20; Type: Standard Label; ManufactpartCode: -; Preferred: False
ZZDIV1 = PCB P22296-2: MFM Sensor(druk); EngPartGrpMainCode: PCB; Preferred: False; PartCode: PCB P22296-2; Type: $PCB; ManufactpartCode: P22296-2; SMD_Flag: False
ZZDIV2 ZZDIV3 = CON STB4F/32 WE: Screw,4p,Fem,P3.81,Straight; EngPartGrpMainCode: CONN; ManufactpartCode: 691361300004-WE; Preferred: False; PartCode: CON STB4F/32 WE; Type: Plug terminal block; SMD_Flag: False

## Nets that join several sheets
GND: MCU (57 pins), Sensor Interface (16 pins), Power (6 pins), Mechanical (H1.0)
VSENSOR: MCU (R10.2), Sensor Interface (12 pins), Power (C10.2 C13.2 R14.2 U5.1)
VSENSORSLOT: MCU (15 pins), Sensor Interface (C3.2 U3.5), Power (5 pins), Mechanical (H2.0)
BUCK_EN: MCU (U4.39), Power (R9.1 U5.5)
CUR_LIMIT_SW: MCU (U4.22), Power (R30.2 T3.G)
ONE_WIRE1: MCU (TS2.1 U4.38), Sensor Interface (D1.C R1.1 R2.2)
ONE_WIRE2: MCU (TS7.1 U4.42), Sensor Interface (D5.C R16.1 R19.2)
SENSOR1_EN: MCU (U4.25), Sensor Interface (R31.1)
SENSOR2_EN: MCU (U4.26), Sensor Interface (R32.1)
USART2_RX: MCU (TS6.1 U4.13), Sensor Interface (U3.4)
USART2_TX: MCU (TS3.1 U4.12), Sensor Interface (U1.2)
USART_~{RX_EN}: MCU (U4.33), Sensor Interface (U2.2)
USART_TX_EN: MCU (R27.2 U4.11), Sensor Interface (U2.3)

## Assembly variants
Production RS485: not fitted C5 C8 D1 D5 J6 R1 R2 R9 R15 R16 R19 R24 S2 XT1; alternate parts J4 -> SolderbridgeNO, J5 -> SolderbridgeNO
Development RS485: not fitted D1 D5 R1 R2 R9 R13 R16 R19 R24
Development Onewire: not fitted C2 C3 C6 R3 R4 R5 R9 R15 R25 U1 U2 U3; alternate parts R14 -> R 806K/60
Production Onewire: not fitted C2 C3 C5 C6 C8 J6 R3 R4 R5 R9 R15 R25 S2 U1 U2 U3 XT1; alternate parts R14 -> R 806K/60